# EAGLE design eksos-rj45-breakout16 (EAGLE 7.7.0)
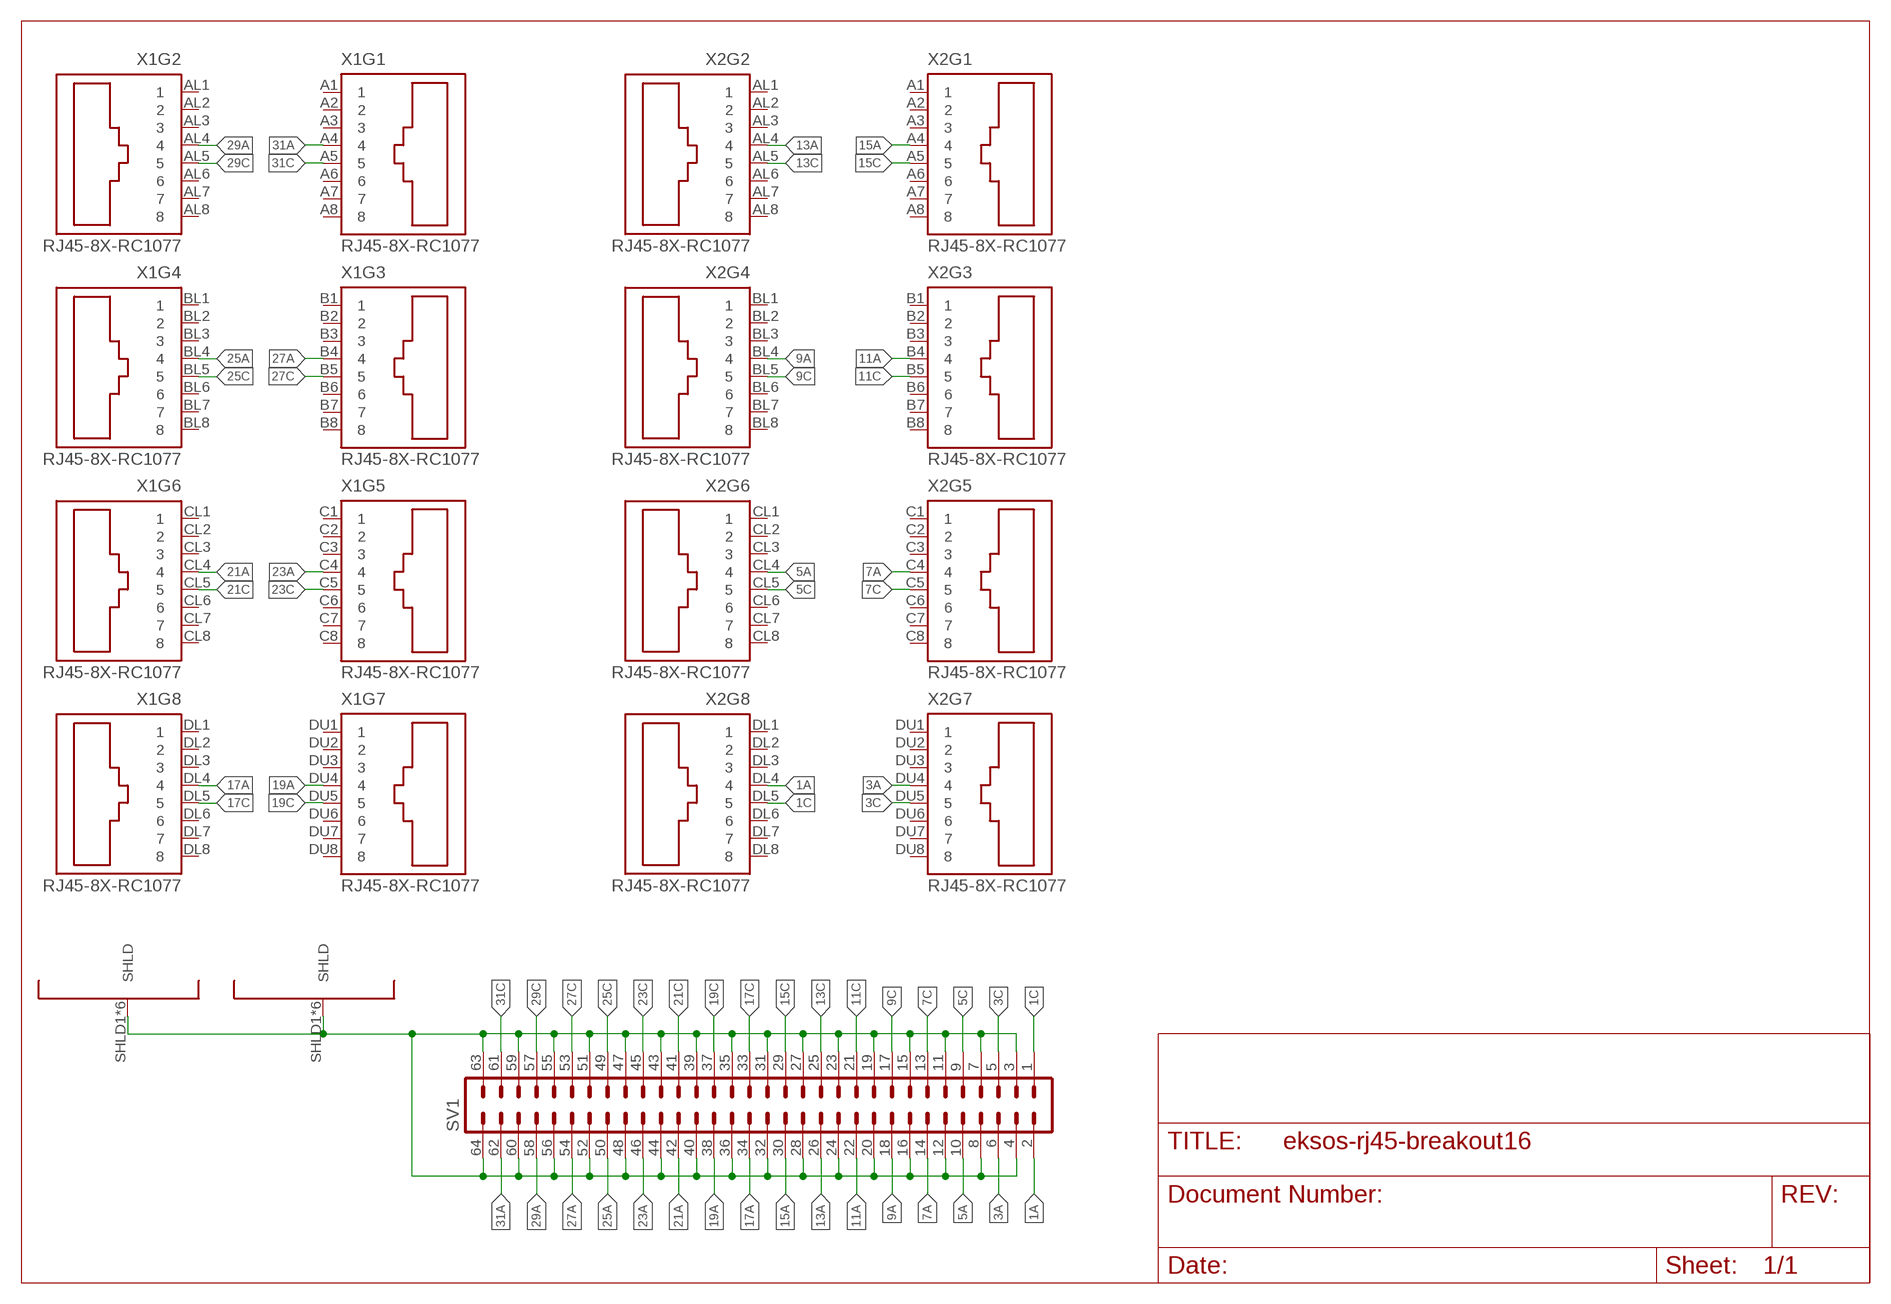
[diagram p0: schematic, sheet 1]

## Parts
SV1  ML64  [ML64]
X1  RJ45-8X-RC1077  [RC01077]
X2  RJ45-8X-RC1077  [RC01077]

## Nets
1A: SV1.2 X2.DL4
1C: SV1.1 X2.DL5
3A: SV1.6 X2.DU4
3C: SV1.5 X2.DU5
5A: SV1.10 X2.CL4
5C: SV1.9 X2.CL5
7A: SV1.14 X2.C4
7C: SV1.13 X2.C5
9A: SV1.18 X2.BL4
9C: SV1.17 X2.BL5
11A: SV1.22 X2.B4
11C: SV1.21 X2.B5
13A: SV1.26 X2.AL4
13C: SV1.25 X2.AL5
15A: SV1.30 X2.A4
15C: SV1.29 X2.A5
17A: SV1.34 X1.DL4
17C: SV1.33 X1.DL5
19A: SV1.38 X1.DU4
19C: SV1.37 X1.DU5
21A: SV1.42 X1.CL4
21C: SV1.41 X1.CL5
23A: SV1.46 X1.C4
23C: SV1.45 X1.C5
25A: SV1.50 X1.BL4
25C: SV1.49 X1.BL5
27A: SV1.54 X1.B4
27C: SV1.53 X1.B5
29A: SV1.58 X1.AL4
29C: SV1.57 X1.AL5
31A: SV1.62 X1.A4
31C: SV1.61 X1.A5
SHLD: SV1.3 SV1.4 SV1.7 SV1.8 SV1.11 SV1.12 SV1.15 SV1.16 SV1.19 SV1.20 SV1.23 SV1.24 SV1.27 SV1.28 SV1.31 SV1.32 SV1.35 SV1.36 SV1.39 SV1.40 SV1.43 SV1.44 SV1.47 SV1.48 SV1.51 SV1.52 SV1.55 SV1.56 SV1.59 SV1.60 SV1.63 SV1.64 X1.SHLD1(SHLD) X1.SHLD2(SHLD) X1.SHLD3(SHLD) X1.SHLD4(SHLD) X1.SHLD5(SHLD) X1.SHLD6(SHLD) X2.SHLD1(SHLD) X2.SHLD2(SHLD) X2.SHLD3(SHLD) X2.SHLD4(SHLD) X2.SHLD5(SHLD) X2.SHLD6(SHLD)
Unconnected: X1.A1 X1.A2 X1.A3 X1.A6 X1.A7 X1.A8 X1.AL1 X1.AL2 X1.AL3 X1.AL6 X1.AL7 X1.AL8 X1.B1 X1.B2 X1.B3 X1.B6 X1.B7 X1.B8 X1.BL1 X1.BL2 X1.BL3 X1.BL6 X1.BL7 X1.BL8 X1.C1 X1.C2 X1.C3 X1.C6 X1.C7 X1.C8 X1.CL1 X1.CL2 X1.CL3 X1.CL6 X1.CL7 X1.CL8 X1.DL1 X1.DL2 X1.DL3 X1.DL6 X1.DL7 X1.DL8 X1.DU1 X1.DU2 X1.DU3 X1.DU6 X1.DU7 X1.DU8 X2.A1 X2.A2 X2.A3 X2.A6 X2.A7 X2.A8 X2.AL1 X2.AL2 X2.AL3 X2.AL6 X2.AL7 X2.AL8 X2.B1 X2.B2 X2.B3 X2.B6 X2.B7 X2.B8 X2.BL1 X2.BL2 X2.BL3 X2.BL6 X2.BL7 X2.BL8 X2.C1 X2.C2 X2.C3 X2.C6 X2.C7 X2.C8 X2.CL1 X2.CL2 X2.CL3 X2.CL6 X2.CL7 X2.CL8 X2.DL1 X2.DL2 X2.DL3 X2.DL6 X2.DL7 X2.DL8 X2.DU1 X2.DU2 X2.DU3 X2.DU6 X2.DU7 X2.DU8

## Library data of the parts
SV1 = con-harting-ml:ML64: HARTING; OC_FARNELL: unknown; OC_NEWARK: unknown
X1 X2 = stewart-rj45:RJ45-8X: 8-port RJ45 jack

## Net classes
0 default: width 0.008 mm

## Board
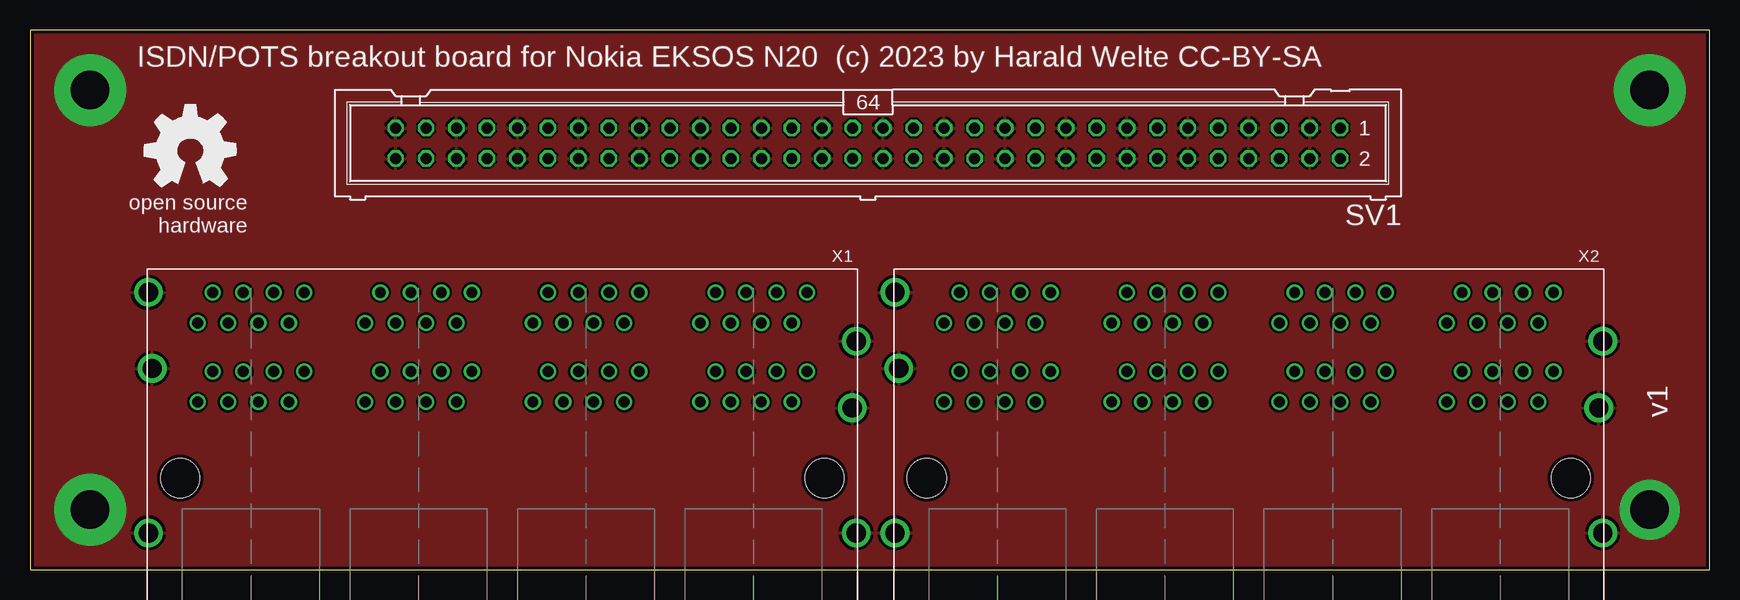
[diagram p1: board, top side]
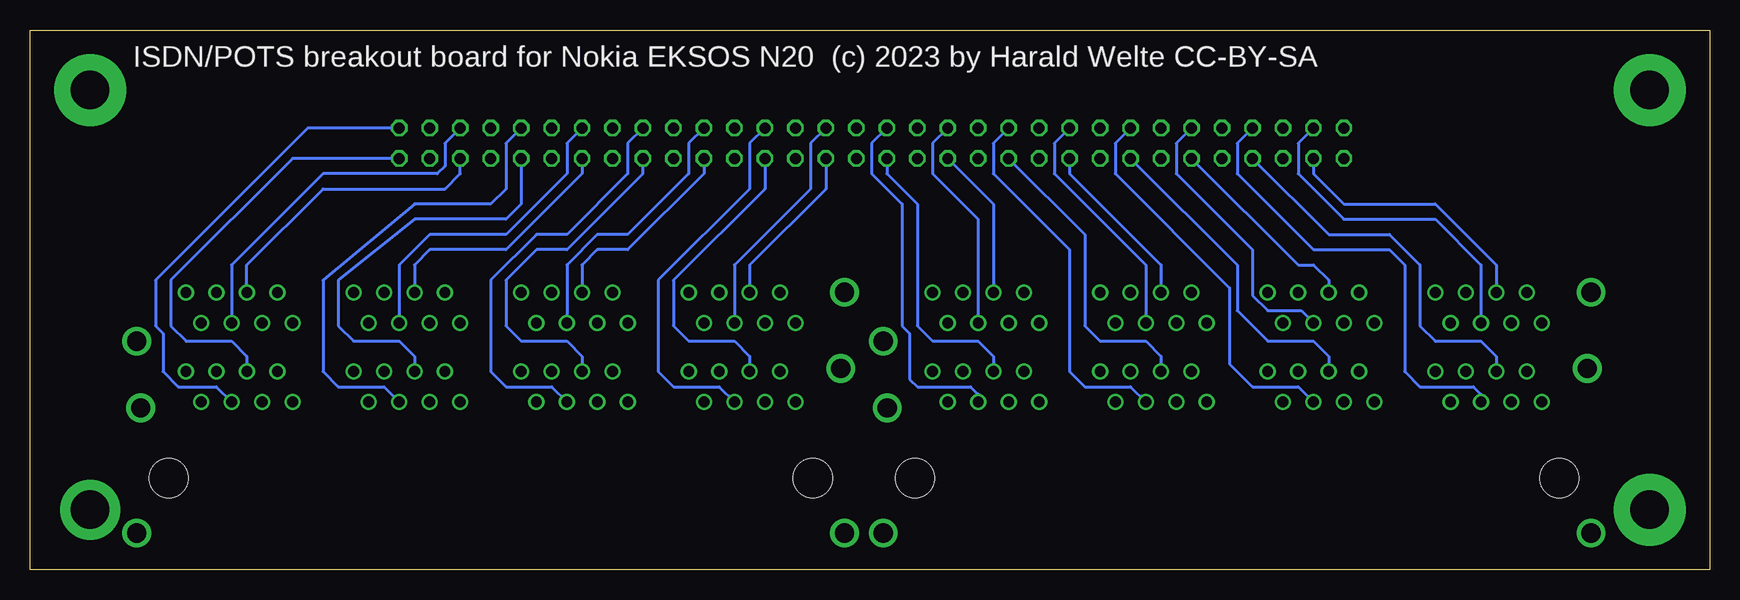
[diagram p2: board, bottom side, seen from below]

Size 140 x 45 mm. Coordinates in mm from the lower left corner, seen from the top.
Outline: 0,0 140,0 140,45 0,45 0,0
Copper layers (1*16): Top 0.035mm / dielectric 1.5mm / Bottom 0.035mm
Design rules "aisler_2_layer_simple": minimum track width 0.2mm, minimum drill 0.45mm, track to track 0.175mm, track to pad 0.175mm, pad to pad 0.175mm, via to via 0.175mm, smd to smd 0.175mm, copper to edge 0.3mm, drill to drill 0.25mm, minimum pad ring 0.2mm, minimum via ring 0.2mm, stop-mask expansion 0mil, vias tented up to drill 0mil, thermal gap 10mil

### Footprints (pad centres in the part's own frame; a part is rotated, then mirrored left to right if it is on the bottom)
ML64 = drill 0.914 octagon: 1 -39.37,-1.27; 2 -39.37,1.27; 3 -36.83,-1.27; 4 -36.83,1.27; 5 -34.29,-1.27; 6 -34.29,1.27; 7 -31.75,-1.27; 8 -31.75,1.27; 9 -29.21,-1.27; 10 -29.21,1.27; 11 -26.67,-1.27; 12 -26.67,1.27; 13 -24.13,-1.27; 14 -24.13,1.27; 15 -21.59,-1.27; 16 -21.59,1.27; 17 -19.05,-1.27; 18 -19.05,1.27; 19 -16.51,-1.27; 20 -16.51,1.27; 21 -13.97,-1.27; 22 -13.97,1.27; 23 -11.43,-1.27; 24 -11.43,1.27; 25 -8.89,-1.27; 26 -8.89,1.27; 27 -6.35,-1.27; 28 -6.35,1.27; 29 -3.81,-1.27; 30 -3.81,1.27; 31 -1.27,-1.27; 32 -1.27,1.27; 33 1.27,-1.27; 34 1.27,1.27; 35 3.81,-1.27; 36 3.81,1.27; 37 6.35,-1.27; 38 6.35,1.27; 39 8.89,-1.27; 40 8.89,1.27; 41 11.43,-1.27; 42 11.43,1.27; 43 13.97,-1.27; 44 13.97,1.27; 45 16.51,-1.27; 46 16.51,1.27; 47 19.05,-1.27; 48 19.05,1.27; 49 21.59,-1.27; 50 21.59,1.27; 51 24.13,-1.27; 52 24.13,1.27; 53 26.67,-1.27; 54 26.67,1.27; 55 29.21,-1.27; 56 29.21,1.27; 57 31.75,-1.27; 58 31.75,1.27; 59 34.29,-1.27; 60 34.29,1.27; 61 36.83,-1.27; 62 36.83,1.27; 63 39.37,-1.27; 64 39.37,1.27
RC01077 = drill 0.9: A1 25.4,-12.95; A2 24.13,-15.49; A3 22.86,-12.95; A4 21.59,-15.49; A5 20.32,-12.95; A6 19.05,-15.49; A7 17.78,-12.95; A8 16.51,-15.49; AL1 25.4,-6.35; AL2 24.13,-8.89; AL3 22.86,-6.35; AL4 21.59,-8.89; AL5 20.32,-6.35; AL6 19.05,-8.89; AL7 17.78,-6.35; AL8 16.51,-8.89; B1 11.43,-12.95; B2 10.16,-15.49; B3 8.89,-12.95; B4 7.62,-15.49; B5 6.35,-12.95; B6 5.08,-15.49; B7 3.81,-12.95; B8 2.54,-15.49; BL1 11.43,-6.35; BL2 10.16,-8.89; BL3 8.89,-6.35; BL4 7.62,-8.89; BL5 6.35,-6.35; BL6 5.08,-8.89; BL7 3.81,-6.35; BL8 2.54,-8.89; C1 -2.54,-12.95; C2 -3.81,-15.49; C3 -5.08,-12.95; C4 -6.35,-15.49; C5 -7.62,-12.95; C6 -8.89,-15.49; C7 -10.16,-12.95; C8 -11.43,-15.49; CL1 -2.54,-6.35; CL2 -3.81,-8.89; CL3 -5.08,-6.35; CL4 -6.35,-8.89; CL5 -7.62,-6.35; CL6 -8.89,-8.89; CL7 -10.16,-6.35; CL8 -11.43,-8.89; DL1 -16.51,-6.35; DL2 -17.78,-8.89; DL3 -19.05,-6.35; DL4 -20.32,-8.89; DL5 -21.59,-6.35; DL6 -22.86,-8.89; DL7 -24.13,-6.35; DL8 -25.4,-8.89; DU1 -16.51,-12.95; DU2 -17.78,-15.49; DU3 -19.05,-12.95; DU4 -20.32,-15.49; DU5 -21.59,-12.95; DU6 -22.86,-15.49; DU7 -24.13,-12.95; DU8 -25.4,-15.49 | drill 1.6: SHLD1 -29.5,4.57; SHLD2 -29.175,-5.85; SHLD3 -29.5,-11.43; SHLD4 29.5,4.57; SHLD5 29.175,-9.15; SHLD6 29.5,-15.5 | hole 3.25: -26.85,0; 26.85,0

### Placement (x,y rotation side)
SV1  69.85,35.56 180 top
U$1  [OSHW_8MM]  13.34,34.92 0 top
X1  39.37,7.62 180 top
X2  101.6,7.62 180 top

### Tracks (layer width: path | path; a pad name or v marks a point on that pad's centre or on a via)
1A
  Bottom 0.254: SV1.2 118.11,34.29 128.27,24.13 128.27,20.32 127,19.05 123.19,19.05 121.92,17.78 X2.DL4
1C
  Bottom 0.254: SV1.1 116.84,36.83 129.54,24.13 129.54,20.32 128.91,19.68 128.91,16.51 127.64,15.24 124.46,15.24 X2.DL5
3A
  Bottom 0.254: X2.DU4 121.92,25.4 115.57,31.75 105.41,31.75 104.14,33.02 SV1.6
3C
  Bottom 0.254: SV1.5 105.41,35.56 105.41,33.66 106.05,33.02 115.57,33.02 123.19,25.4 X2.DU5
5A
  Bottom 0.254: SV1.10 99.06,30.48 100.33,29.21 107.95,29.21 114.3,24.13 114.3,20.32 113.03,19.05 109.22,19.05 107.95,17.78 X2.CL4
5C
  Bottom 0.254: SV1.9 100.33,35.56 100.33,31.75 101.6,30.48 107.95,30.48 115.57,24.13 115.57,16.51 114.3,15.24 110.49,15.24 X2.CL5
7A
  Bottom 0.254: SV1.14 93.98,33.02 100.33,26.67 106.68,26.67 107.95,25.4 X2.C4
7C
  Bottom 0.254: SV1.13 95.25,35.56 95.25,33.02 100.33,27.94 106.68,27.94 109.22,25.4 X2.C5
9A
  Bottom 0.254: X2.BL4 93.98,17.78 95.25,19.05 99.06,19.05 100.33,20.32 100.33,24.13 97.79,26.67 95.25,26.67 88.9,33.02 SV1.18
9C
  Bottom 0.254: SV1.17 90.17,35.56 90.17,33.02 95.25,27.94 97.79,27.94 101.6,24.13 101.6,16.51 100.33,15.24 96.52,15.24 X2.BL5
11A
  Bottom 0.254: SV1.22 83.82,33.02 90.17,26.67 92.71,26.67 93.98,25.4 X2.B4
11C
  Bottom 0.254: SV1.21 85.09,35.56 85.09,33.02 90.17,27.94 92.71,27.94 95.25,25.4 X2.B5
13A
  Bottom 0.254: SV1.26 78.74,31.75 86.36,24.13 86.36,20.32 85.09,19.05 81.28,19.05 80.01,17.78 X2.AL4
13C
  Bottom 0.254: SV1.25 80.01,35.56 80.01,31.75 87.63,24.13 87.63,16.51 86.36,15.24 82.55,15.24 X2.AL5
15A
  Bottom 0.254: SV1.30 73.66,31.75 80.01,25.4 X2.A4
15C
  Bottom 0.254: SV1.29 74.93,35.56 74.93,31.75 81.28,25.4 X2.A5
17A
  Bottom 0.254: SV1.34 68.58,33.02 66.04,30.48 66.04,20.32 64.77,19.05 60.96,19.05 59.69,17.78 X1.DL4
17C
  Bottom 0.254: SV1.33 69.85,35.56 69.85,33.02 67.31,30.48 67.31,20.32 66.67,19.68 66.67,15.88 66.04,15.24 61.59,15.24 60.96,14.61 X1.DL5
19A
  Bottom 0.254: SV1.38 59.69,30.48 X1.DU4
19C
  Bottom 0.254: SV1.37 64.77,35.56 64.77,33.02 60.96,29.21 X1.DU5
21A
  Bottom 0.254: SV1.42 52.07,27.94 52.07,20.32 50.8,19.05 46.99,19.05 45.72,17.78 X1.CL4
21C
  Bottom 0.254: SV1.41 59.69,35.56 59.69,33.02 53.34,26.67 53.34,16.51 52.07,15.24 48.26,15.24 X1.CL5
23A
  Bottom 0.254: SV1.46 53.34,33.02 45.72,25.4 X1.C4
23C
  Bottom 0.254: SV1.45 54.61,35.56 54.61,33.02 46.99,25.4 X1.C5
25A
  Bottom 0.254: SV1.50 39.37,25.4 39.37,21.59 36.83,19.05 33.02,19.05 31.75,17.78 X1.BL4
25C
  Bottom 0.254: SV1.49 49.53,35.56 49.53,33.02 40.01,23.5 40.01,17.14 38.1,15.24 34.29,15.24 X1.BL5
27A
  Bottom 0.254: SV1.54 34.29,25.4 33.02,25.4 31.75,24.13 X1.B4
27C
  Bottom 0.254: SV1.53 44.45,35.56 44.45,33.02 38.1,26.67 38.1,22.86 36.83,21.59 34.04,21.59 X1.B5
29A
  Bottom 0.254: SV1.58 31.75,27.94 26.67,27.94 24.13,25.4 24.13,20.32 22.86,19.05 19.05,19.05 17.78,17.78 X1.AL4
29C
  Bottom 0.254: SV1.57 39.37,35.56 39.37,33.02 33.02,26.67 26.67,26.67 25.4,25.4 25.4,16.51 24.13,15.24 19.68,15.24 19.05,14.61 X1.AL5
31A
  Bottom 0.254: SV1.62 33.02,33.02 30.48,30.48 22.86,30.48 17.78,25.4 X1.A4
31C
  Bottom 0.254: SV1.61 34.29,35.56 34.29,33.02 30.48,29.21 22.86,29.21 19.05,25.4 X1.A5
SHLD  (via drill 3.2 pad 5, 3.2 pad 6)
  other vias: 5,40 135,40 5,5 135,5
  pour Top: 0,0 0,45 140,45 140,0

### Text on the board
tNames: ISDN/POTS breakout board for Nokia EKSOS N20 (c) 2023 by Harald Welte CC-BY-SA
bNames: ISDN/POTS breakout board for Nokia EKSOS N20 (c) 2023 by Harald Welte CC-BY-SA